# Altium project BEE-1012 PAY-EXP_V110.PrjPcb (part 6 of 7)

## Sheet 19_SOLENOID_HB_1.SchDoc
size 420 x 297 mm; SheetNumber: 31; SheetTotal: 36
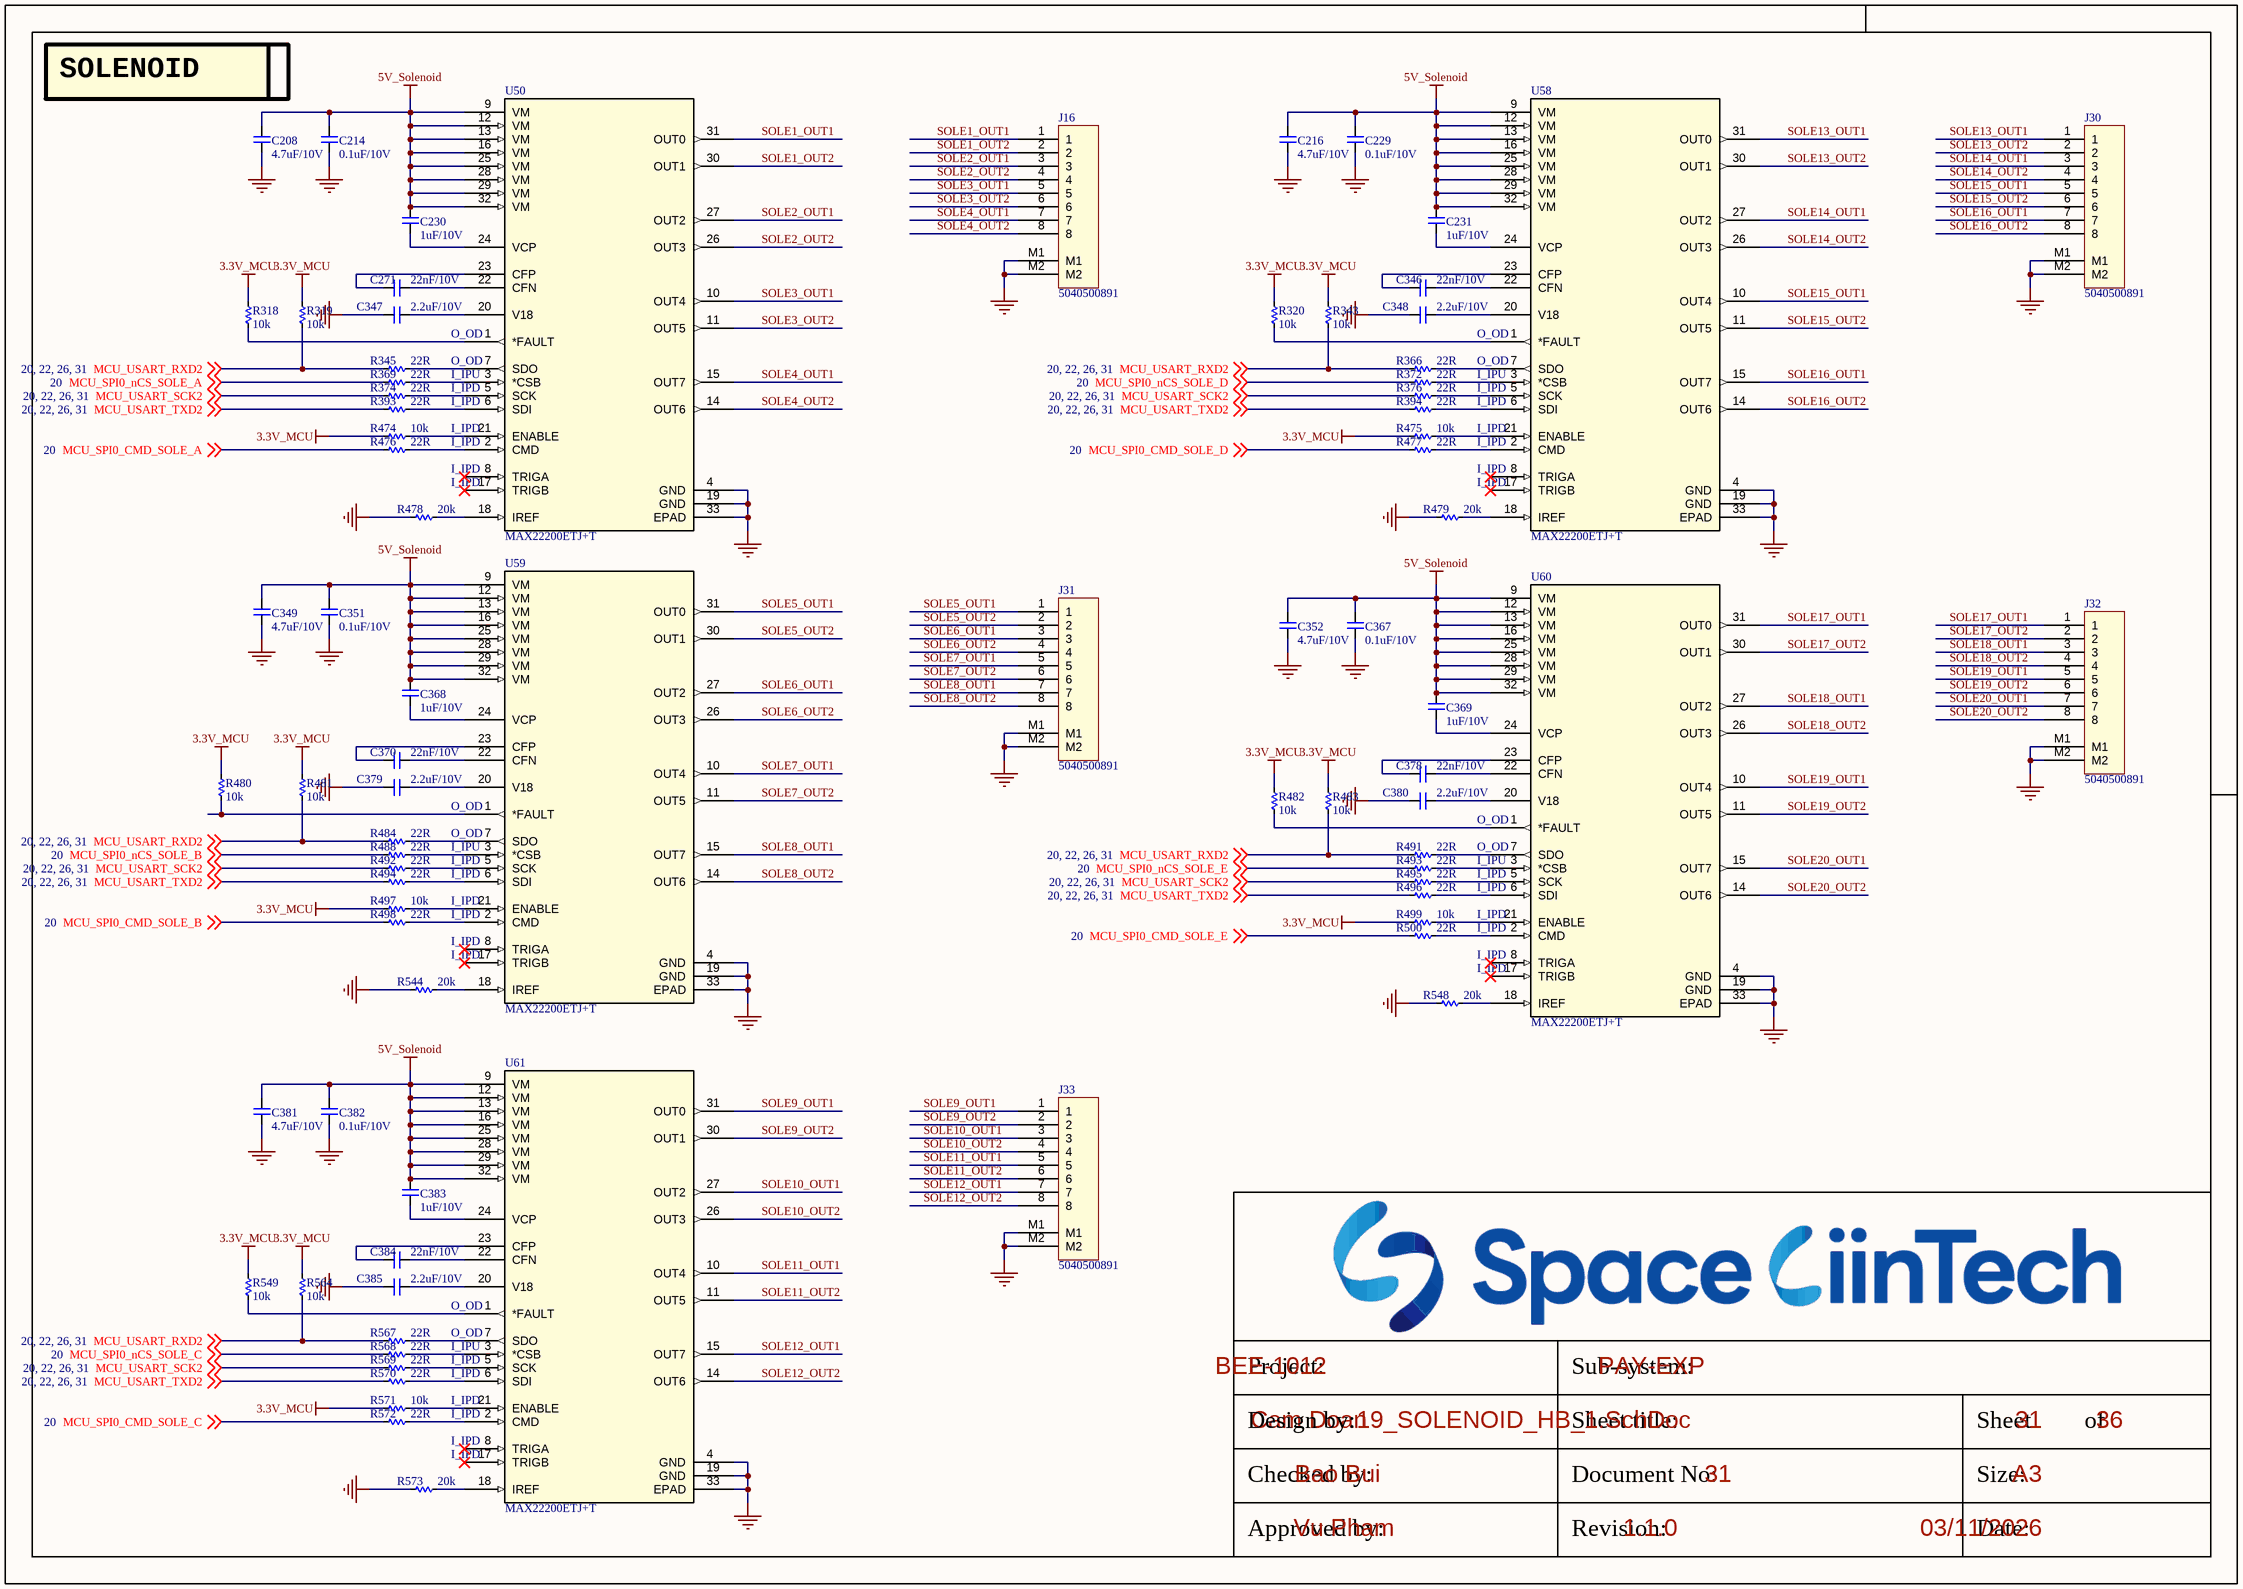
[diagram p32: 19_SOLENOID_HB_1.SchDoc]

### Parts
C208  4.7uF/10V  [CAP_C_1005X60]
C214  0.1uF/10V  [CAP_C_1005X60]
C216  4.7uF/10V  [CAP_C_1005X60]
C229  0.1uF/10V  [CAP_C_1005X60]
C230  1uF/10V  [CAP_C_1005X60]
C231  1uF/10V  [CAP_C_1005X60]
C271  22nF/10V  [CAP_C_1005X60]
C346  22nF/10V  [CAP_C_1005X60]
C347  2.2uF/10V  [CAP_C_1005X60]
C348  2.2uF/10V  [CAP_C_1005X60]
C349  4.7uF/10V  [CAP_C_1005X60]
C351  0.1uF/10V  [CAP_C_1005X60]
C352  4.7uF/10V  [CAP_C_1005X60]
C367  0.1uF/10V  [CAP_C_1005X60]
C368  1uF/10V  [CAP_C_1005X60]
C369  1uF/10V  [CAP_C_1005X60]
C370  22nF/10V  [CAP_C_1005X60]
C378  22nF/10V  [CAP_C_1005X60]
C379  2.2uF/10V  [CAP_C_1005X60]
C380  2.2uF/10V  [CAP_C_1005X60]
C381  4.7uF/10V  [CAP_C_1005X60]
C382  0.1uF/10V  [CAP_C_1005X60]
C383  1uF/10V  [CAP_C_1005X60]
C384  22nF/10V  [CAP_C_1005X60]
C385  2.2uF/10V  [CAP_C_1005X60]
J16  5040500891  [MOLEX_5040500891]
J30  5040500891  [MOLEX_5040500891]
J31  5040500891  [MOLEX_5040500891]
J32  5040500891  [MOLEX_5040500891]
J33  5040500891  [MOLEX_5040500891]
R318  10k  [RES_C_1005X40]
R319  10k  [RES_C_1005X40]
R320  10k  [RES_C_1005X40]
R343  10k  [RES_C_1005X40]
R345  22R  [RES_C_1005X40]
R366  22R  [RES_C_1005X40]
R369  22R  [RES_C_1005X40]
R372  22R  [RES_C_1005X40]
R374  22R  [RES_C_1005X40]
R376  22R  [RES_C_1005X40]
R393  22R  [RES_C_1005X40]
R394  22R  [RES_C_1005X40]
R474  10k  [RES_C_1005X40]
R475  10k  [RES_C_1005X40]
R476  22R  [RES_C_1005X40]
R477  22R  [RES_C_1005X40]
R478  20k  [RES_C_1005X40]
R479  20k  [RES_C_1005X40]
R480  10k  [RES_C_1005X40]
R481  10k  [RES_C_1005X40]
R482  10k  [RES_C_1005X40]
R483  10k  [RES_C_1005X40]
R484  22R  [RES_C_1005X40]
R488  22R  [RES_C_1005X40]
R491  22R  [RES_C_1005X40]
R492  22R  [RES_C_1005X40]
R493  22R  [RES_C_1005X40]
R494  22R  [RES_C_1005X40]
R495  22R  [RES_C_1005X40]
R496  22R  [RES_C_1005X40]
R497  10k  [RES_C_1005X40]
R498  22R  [RES_C_1005X40]
R499  10k  [RES_C_1005X40]
R500  22R  [RES_C_1005X40]
R544  20k  [RES_C_1005X40]
R548  20k  [RES_C_1005X40]
R549  10k  [RES_C_1005X40]
R564  10k  [RES_C_1005X40]
R567  22R  [RES_C_1005X40]
R568  22R  [RES_C_1005X40]
R569  22R  [RES_C_1005X40]
R570  22R  [RES_C_1005X40]
R571  10k  [RES_C_1005X40]
R572  22R  [RES_C_1005X40]
R573  20k  [RES_C_1005X40]
U50  MAX22200ETJ+T  [21-0140AK_T3255_8C_MXM]
U58  MAX22200ETJ+T  [21-0140AK_T3255_8C_MXM]
U59  MAX22200ETJ+T  [21-0140AK_T3255_8C_MXM]
U60  MAX22200ETJ+T  [21-0140AK_T3255_8C_MXM]
U61  MAX22200ETJ+T  [21-0140AK_T3255_8C_MXM]

### Nets
3.3V_MCU: R318.1 R319.1 R320.1 R343.1 R474.1 R475.1 R480.1 R481.1 R482.1 R483.1 R497.1 R499.1 R549.1 R564.1 R571.1
5V_Solenoid: C208.2 C214.2 C216.2 C229.2 C230.2 C231.2 C349.2 C351.2 C352.2 C367.2 C368.2 C369.2 C381.2 C382.2 C383.2 U50.9(VM) U50.12(VM) U50.13(VM) U50.16(VM) U50.25(VM) U50.28(VM) U50.29(VM) U50.32(VM) U58.9(VM) U58.12(VM) U58.13(VM) U58.16(VM) U58.25(VM) U58.28(VM) U58.29(VM) U58.32(VM) U59.9(VM) U59.12(VM) U59.13(VM) U59.16(VM) U59.25(VM) U59.28(VM) U59.29(VM) U59.32(VM) U60.9(VM) U60.12(VM) U60.13(VM) U60.16(VM) U60.25(VM) U60.28(VM) U60.29(VM) U60.32(VM) U61.9(VM) U61.12(VM) U61.13(VM) U61.16(VM) U61.25(VM) U61.28(VM) U61.29(VM) U61.32(VM)
GND: C208.1 C214.1 C216.1 C229.1 C347.1 C348.1 C349.1 C351.1 C352.1 C367.1 C379.1 C380.1 C381.1 C382.1 C385.1 J16.M1 J16.M2 J30.M1 J30.M2 J31.M1 J31.M2 J32.M1 J32.M2 J33.M1 J33.M2 R478.1 R479.1 R544.1 R548.1 R573.1 U50.4(GND) U50.19(GND) U50.33(EPAD) U58.4(GND) U58.19(GND) U58.33(EPAD) U59.4(GND) U59.19(GND) U59.33(EPAD) U60.4(GND) U60.19(GND) U60.33(EPAD) U61.4(GND) U61.19(GND) U61.33(EPAD)
MCU_SPI0_CMD_SOLE_A: R476.1 ; off-sheet MCU_SPI0_CMD_SOLE_A
MCU_SPI0_CMD_SOLE_B: R498.1 ; off-sheet MCU_SPI0_CMD_SOLE_B
MCU_SPI0_CMD_SOLE_C: R572.1 ; off-sheet MCU_SPI0_CMD_SOLE_C
MCU_SPI0_CMD_SOLE_D: R477.1 ; off-sheet MCU_SPI0_CMD_SOLE_D
MCU_SPI0_CMD_SOLE_E: R500.1 ; off-sheet MCU_SPI0_CMD_SOLE_E
MCU_SPI0_nCS_SOLE_A: R369.1 ; off-sheet MCU_SPI0_nCS_SOLE_A
MCU_SPI0_nCS_SOLE_B: R488.1 ; off-sheet MCU_SPI0_nCS_SOLE_B
MCU_SPI0_nCS_SOLE_C: R568.1 ; off-sheet MCU_SPI0_nCS_SOLE_C
MCU_SPI0_nCS_SOLE_D: R372.1 ; off-sheet MCU_SPI0_nCS_SOLE_D
MCU_SPI0_nCS_SOLE_E: R493.1 ; off-sheet MCU_SPI0_nCS_SOLE_E
MCU_USART_RXD2: R319.2 R343.2 R345.1 R366.1 R481.2 R483.2 R484.1 R491.1 R564.2 R567.1 ; off-sheet MCU_USART_RXD2
MCU_USART_SCK2: R374.1 R376.1 R492.1 R495.1 R569.1 ; off-sheet MCU_USART_SCK2
MCU_USART_TXD2: R393.1 R394.1 R494.1 R496.1 R570.1 ; off-sheet MCU_USART_TXD2
SOLE1_OUT1: J16.1 U50.31(OUT0)
SOLE1_OUT2: J16.2 U50.30(OUT1)
SOLE2_OUT1: J16.3 U50.27(OUT2)
SOLE2_OUT2: J16.4 U50.26(OUT3)
SOLE3_OUT1: J16.5 U50.10(OUT4)
SOLE3_OUT2: J16.6 U50.11(OUT5)
SOLE4_OUT1: J16.7 U50.15(OUT7)
SOLE4_OUT2: J16.8 U50.14(OUT6)
SOLE5_OUT1: J31.1 U59.31(OUT0)
SOLE5_OUT2: J31.2 U59.30(OUT1)
SOLE6_OUT1: J31.3 U59.27(OUT2)
SOLE6_OUT2: J31.4 U59.26(OUT3)
SOLE7_OUT1: J31.5 U59.10(OUT4)
SOLE7_OUT2: J31.6 U59.11(OUT5)
SOLE8_OUT1: J31.7 U59.15(OUT7)
SOLE8_OUT2: J31.8 U59.14(OUT6)
SOLE9_OUT1: J33.1 U61.31(OUT0)
SOLE9_OUT2: J33.2 U61.30(OUT1)
SOLE10_OUT1: J33.3 U61.27(OUT2)
SOLE10_OUT2: J33.4 U61.26(OUT3)
SOLE11_OUT1: J33.5 U61.10(OUT4)
SOLE11_OUT2: J33.6 U61.11(OUT5)
SOLE12_OUT1: J33.7 U61.15(OUT7)
SOLE12_OUT2: J33.8 U61.14(OUT6)
SOLE13_OUT1: J30.1 U58.31(OUT0)
SOLE13_OUT2: J30.2 U58.30(OUT1)
SOLE14_OUT1: J30.3 U58.27(OUT2)
SOLE14_OUT2: J30.4 U58.26(OUT3)
SOLE15_OUT1: J30.5 U58.10(OUT4)
SOLE15_OUT2: J30.6 U58.11(OUT5)
SOLE16_OUT1: J30.7 U58.15(OUT7)
SOLE16_OUT2: J30.8 U58.14(OUT6)
SOLE17_OUT1: J32.1 U60.31(OUT0)
SOLE17_OUT2: J32.2 U60.30(OUT1)
SOLE18_OUT1: J32.3 U60.27(OUT2)
SOLE18_OUT2: J32.4 U60.26(OUT3)
SOLE19_OUT1: J32.5 U60.10(OUT4)
SOLE19_OUT2: J32.6 U60.11(OUT5)
SOLE20_OUT1: J32.7 U60.15(OUT7)
SOLE20_OUT2: J32.8 U60.14(OUT6)
NetC230_1: C230.1 U50.24(VCP)
NetC231_1: C231.1 U58.24(VCP)
NetC271_1: C271.1 U50.22(CFN)
NetC271_2: C271.2 U50.23(CFP)
NetC346_1: C346.1 U58.22(CFN)
NetC346_2: C346.2 U58.23(CFP)
NetC347_2: C347.2 U50.20(V18)
NetC348_2: C348.2 U58.20(V18)
NetC368_1: C368.1 U59.24(VCP)
NetC369_1: C369.1 U60.24(VCP)
NetC370_1: C370.1 U59.22(CFN)
NetC370_2: C370.2 U59.23(CFP)
NetC378_1: C378.1 U60.22(CFN)
NetC378_2: C378.2 U60.23(CFP)
NetC379_2: C379.2 U59.20(V18)
NetC380_2: C380.2 U60.20(V18)
NetC383_1: C383.1 U61.24(VCP)
NetC384_1: C384.1 U61.22(CFN)
NetC384_2: C384.2 U61.23(CFP)
NetC385_2: C385.2 U61.20(V18)
NetR318_2: R318.2 U50.1(*FAULT)
NetR320_2: R320.2 U58.1(*FAULT)
NetR345_2: R345.2 U50.7(SDO)
NetR366_2: R366.2 U58.7(SDO)
NetR369_2: R369.2 U50.3(*CSB)
NetR372_2: R372.2 U58.3(*CSB)
NetR374_2: R374.2 U50.5(SCK)
NetR376_2: R376.2 U58.5(SCK)
NetR393_2: R393.2 U50.6(SDI)
NetR394_2: R394.2 U58.6(SDI)
NetR474_2: R474.2 U50.21(ENABLE)
NetR475_2: R475.2 U58.21(ENABLE)
NetR476_2: R476.2 U50.2(CMD)
NetR477_2: R477.2 U58.2(CMD)
NetR478_2: R478.2 U50.18(IREF)
NetR479_2: R479.2 U58.18(IREF)
NetR480_2: R480.2 U59.1(*FAULT)
NetR482_2: R482.2 U60.1(*FAULT)
NetR484_2: R484.2 U59.7(SDO)
NetR488_2: R488.2 U59.3(*CSB)
NetR491_2: R491.2 U60.7(SDO)
NetR492_2: R492.2 U59.5(SCK)
NetR493_2: R493.2 U60.3(*CSB)
NetR494_2: R494.2 U59.6(SDI)
NetR495_2: R495.2 U60.5(SCK)
NetR496_2: R496.2 U60.6(SDI)
NetR497_2: R497.2 U59.21(ENABLE)
NetR498_2: R498.2 U59.2(CMD)
NetR499_2: R499.2 U60.21(ENABLE)
NetR500_2: R500.2 U60.2(CMD)
NetR544_2: R544.2 U59.18(IREF)
NetR548_2: R548.2 U60.18(IREF)
NetR549_2: R549.2 U61.1(*FAULT)
NetR567_2: R567.2 U61.7(SDO)
NetR568_2: R568.2 U61.3(*CSB)
NetR569_2: R569.2 U61.5(SCK)
NetR570_2: R570.2 U61.6(SDI)
NetR571_2: R571.2 U61.21(ENABLE)
NetR572_2: R572.2 U61.2(CMD)
NetR573_2: R573.2 U61.18(IREF)

Not connected (* = marked no-connect by the designer): U50 8(TRIGA)* 17(TRIGB)*; U58 8(TRIGA)* 17(TRIGB)*; U59 8(TRIGA)* 17(TRIGB)*; U60 8(TRIGA)* 17(TRIGB)*; U61 8(TRIGA)* 17(TRIGB)*

### Notes on the sheet
- SOLENOID
- O_OD
- (near U50) I_IPU
- (near U50) I_IPD
- (near U50) O_OD
- (near U58) I_IPU
- (near U58) I_IPD
- (near U58) O_OD
- I_IPD
- (near U59) I_IPU
- (near U59) I_IPD
- (near U59) O_OD
- (near U60) I_IPU
- (near U60) O_OD
- (near U60) I_IPD
- (near U61) O_OD
- (near U61) I_IPU
- (near U61) I_IPD
- Project:
- Sub-system:
- Design by:
- Sheet title:
- Sheet
- of
- Checked by:
- Approved by:
- Revision:
- Document No:
- Size:
- Date:
- A3

### Library data of the parts
C208 C214 C216 C229-C231 C271 C346-C349 C351 C352 C367-C370 C378-C385 = _CAP_C_2: CAP CHIP
J16 J30-J33 = Header 8x1_2M
R318-R320 R343 R345 R366 R369 R372 R374 R376 R393 R394 R474-R484 R488 R491-R500 R544 R548 R549 R564 R567-R573 = _RES_B_2: RES
U50 U58-U61 = MAX22200ETJ+T: 36V, 1A Octal Integrated Serial-Controlled Solenoid and Motor Driver; Manufacturer_Name: Analog Devices Inc; Copyright: Copyright (C) 2026 Ultra Librarian. All rights reserved.; Manufacturer_Part_Number: MAX22200ETJ+T; RefDes: RefDes; Type: Type

## Sheet 19_SOLENOID_OF.SchDoc
size 420 x 297 mm; SheetNumber: 33; SheetTotal: 36
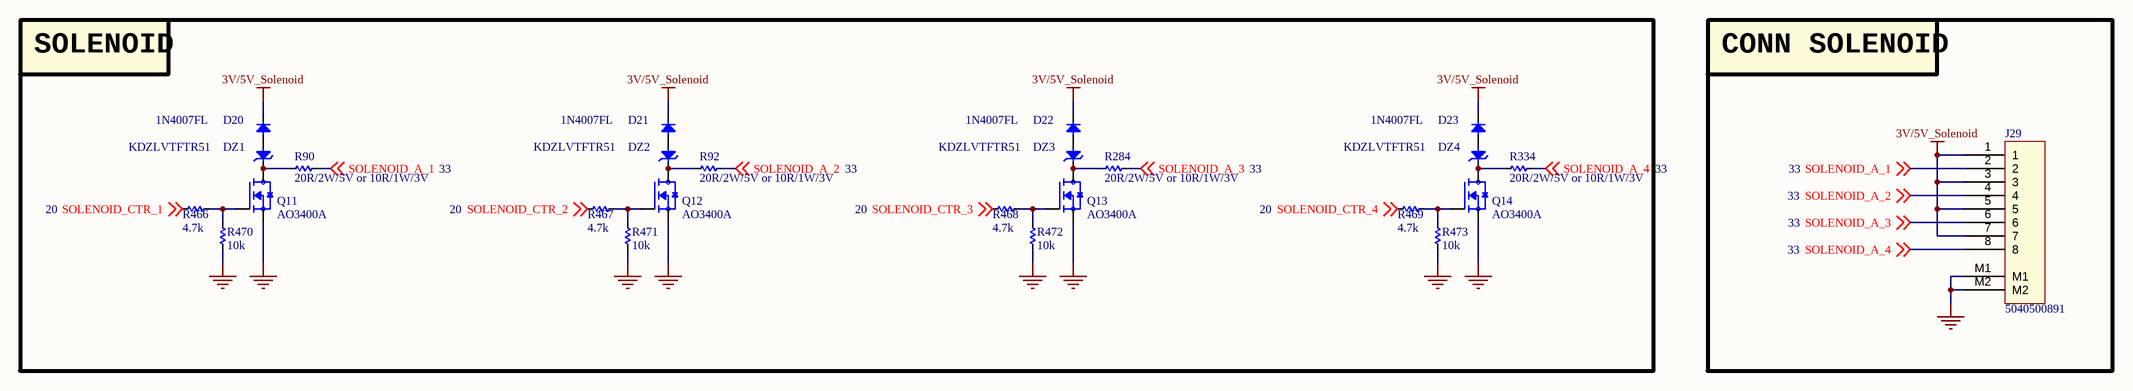
[diagram p33: 19_SOLENOID_OF.SchDoc]

### Parts
D20  1N4007FL  [SOD3717X145N]
D21  1N4007FL  [SOD3717X145N]
D22  1N4007FL  [SOD3717X145N]
D23  1N4007FL  [SOD3717X145N]
DZ1  KDZLVTFTR51  [SOD3717X145N]
DZ2  KDZLVTFTR51  [SOD3717X145N]
DZ3  KDZLVTFTR51  [SOD3717X145N]
DZ4  KDZLVTFTR51  [SOD3717X145N]
J29  5040500891  [MOLEX_5040500891]
Q11  AO3400A  [SOT95P240X120-3N]
Q12  AO3400A  [SOT95P240X120-3N]
Q13  AO3400A  [SOT95P240X120-3N]
Q14  AO3400A  [SOT95P240X120-3N]
R90  20R/2W/5V or 10R/1W/3V  [RES_C_6331X65_N]
R92  20R/2W/5V or 10R/1W/3V  [RES_C_6331X65_N]
R284  20R/2W/5V or 10R/1W/3V  [RES_C_6331X65_N]
R334  20R/2W/5V or 10R/1W/3V  [RES_C_6331X65_N]
R466  4.7k  [RES_C_1005X40]
R467  4.7k  [RES_C_1005X40]
R468  4.7k  [RES_C_1005X40]
R469  4.7k  [RES_C_1005X40]
R470  10k  [RES_C_1005X40]
R471  10k  [RES_C_1005X40]
R472  10k  [RES_C_1005X40]
R473  10k  [RES_C_1005X40]

### Blocks framed on the sheet
SOLENOID: D20-D23 DZ1-DZ4 Q11-Q14 R90 R92 R284 R334 R466-R473
CONN SOLENOID: J29

### Nets
3V/5V_Solenoid: D20.1(K) D21.1(K) D22.1(K) D23.1(K) J29.1 J29.3 J29.5 J29.7
GND: J29.M1 J29.M2 Q11.2(S) Q12.2(S) Q13.2(S) Q14.2(S) R470.1 R471.1 R472.1 R473.1
SOLENOID_A_1: J29.2 R90.1 ; off-sheet SOLENOID_A_1
SOLENOID_A_2: J29.4 R92.1 ; off-sheet SOLENOID_A_2
SOLENOID_A_3: J29.6 R284.1 ; off-sheet SOLENOID_A_3
SOLENOID_A_4: J29.8 R334.1 ; off-sheet SOLENOID_A_4
SOLENOID_CTR_1: R466.2 ; off-sheet SOLENOID_CTR_1
SOLENOID_CTR_2: R467.2 ; off-sheet SOLENOID_CTR_2
SOLENOID_CTR_3: R468.2 ; off-sheet SOLENOID_CTR_3
SOLENOID_CTR_4: R469.2 ; off-sheet SOLENOID_CTR_4
NetD20_2: D20.2(A) DZ1.2(A)
NetD21_2: D21.2(A) DZ2.2(A)
NetD22_2: D22.2(A) DZ3.2(A)
NetD23_2: D23.2(A) DZ4.2(A)
NetDZ1_1: DZ1.1(K) Q11.3(D) R90.2
NetDZ2_1: DZ2.1(K) Q12.3(D) R92.2
NetDZ3_1: DZ3.1(K) Q13.3(D) R284.2
NetDZ4_1: DZ4.1(K) Q14.3(D) R334.2
NetQ11_1: Q11.1(G) R466.1 R470.2
NetQ12_1: Q12.1(G) R467.1 R471.2
NetQ13_1: Q13.1(G) R468.1 R472.2
NetQ14_1: Q14.1(G) R469.1 R473.2

### Notes on the sheet
- Project:
- Sub-system:
- Design by:
- Sheet title:
- Sheet
- of
- Checked by:
- Approved by:
- Revision:
- Document No:
- Size:
- Date:
- A3

### Library data of the parts
D20-D23 = Diode SMD: as D5 on sheet 15_HEATER; Published: 8-Jun-2000; Revision: July-2002: Re-released for DXP Platform.; Publisher: Altium Limited
DZ1-DZ4 = DIODE Zener: Zenner
J29 = Header 8x1_2M
Q11-Q14 = MOSFET_N: as Q3 on sheet 15_HEATER; SnapEDA_Link: https://www.snapeda.com/parts/AO3400A/Alpha/view-part/?ref=snap; Package: SOT-23 Alpha &amp; Omega Semiconductor Inc.; Value: *; MP: AO3400A; Check_prices: https://www.snapeda.com/parts/AO3400A/Alpha/view-part/?ref=eda
R90 R92 R284 R334 R466-R473 = _RES_B_2: RES

## Sheet 20_AI_Board.SchDoc
size 420 x 297 mm; SheetNumber: 33; SheetTotal: 35
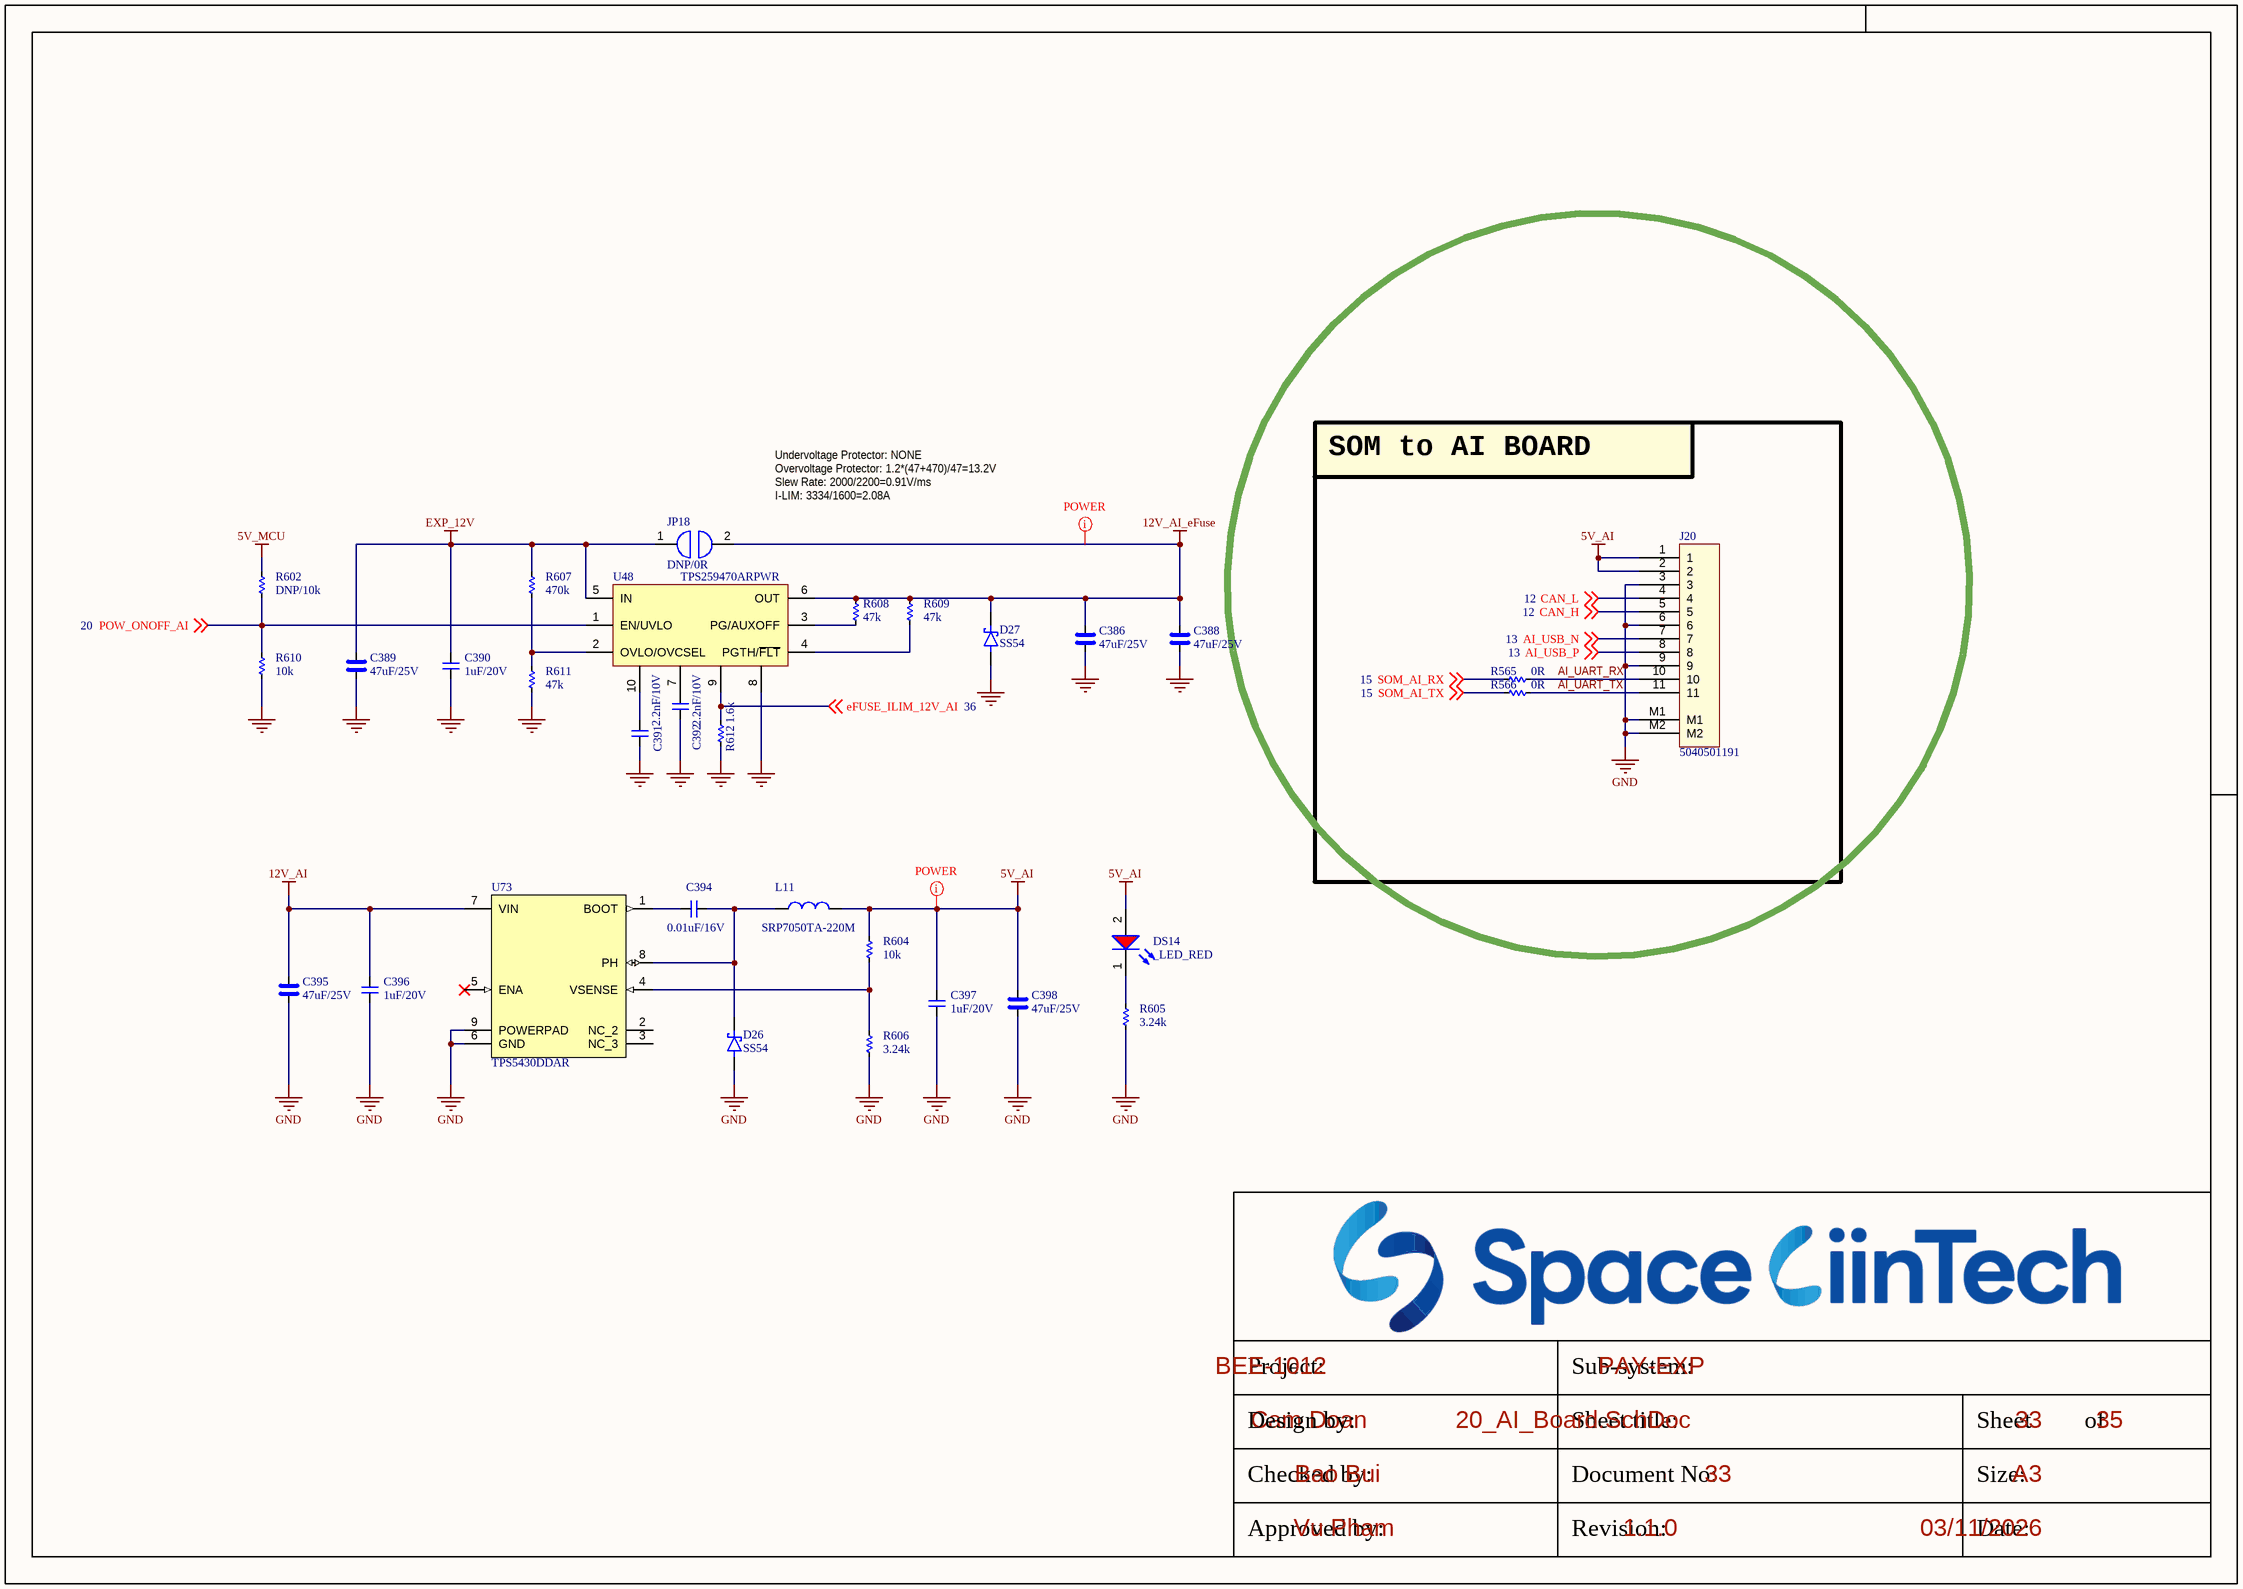
[diagram p34: 20_AI_Board.SchDoc]

### Parts
(Parts that share a designator on the sheet are numbered #1, #2 ... from top to bottom, then left to right.)
C386  47uF/25V  [CAP_C_3225X80]
C388  47uF/25V  [CAP_C_3225X80]
C389  47uF/25V  [CAP_C_3225X80]
C390  1uF/20V  [CAP_C_1005X60]
C391  2.2nF/10V  [CAP_C_1005X60]
C392  2.2nF/10V  [CAP_C_1005X60]
C394  0.01uF/16V  [CAP_C_1608X80]
C395  47uF/25V  [CAP_C_3225X80]
C396  1uF/20V  [CAP_C_1005X60]
C397  1uF/20V  [CAP_C_1005X60]
C398  47uF/25V  [CAP_C_3225X80]
D26  SS54  [DO-214AC_SMA]
D27  SS54  [DO-214AC_SMA]
DS14  _LED_RED  [LED_0603]
J20  5040501191  [MOLEX_5040501191]
JP18  DNP/0R  [JUMPER_1608]
L11  SRP7050TA-220M  [PSM6050]
R565  0R  [RES_C_1005X40]
R566  0R  [RES_C_1005X40]
R602  DNP/10k  [RES_C_1005X40]
R604  10k  [RES_C_1005X40]
R605  3.24k  [RES_C_1005X40]
R606  3.24k  [RES_C_1005X40]
R607  470k  [RES_C_1005X40]
R608  47k  [RES_C_1005X40]
R609  47k  [RES_C_1005X40]
R610  10k  [RES_C_1005X40]
R611  47k  [RES_C_1005X40]
R612  1.6k  [RES_C_1005X40]
U48  TPS259470ARPWR  [VQFN-HR-10]
U73#2  TPS5430DDAR  [TPS54531DDAR]

### Blocks framed on the sheet
SOM to AI BOARD: J20 R565 R566

### Nets
5V_AI: C397.2 C398.2 DS14.2(A) J20.1 J20.2 L11.2 R604.2
5V_MCU: R602.1
12V_AI: C395.2 C396.2 U73#2.7(VIN)
12V_AI_eFuse: C386.2 C388.2 D27.1(K) JP18.2 R608.2 R609.2 U48.6(OUT)
EXP_12V: C389.2 C390.2 JP18.1 R607.2 U48.5(IN)
GND: C386.1 C388.1 C389.1 C390.1 C391.1 C392.1 C395.1 C396.1 C397.1 C398.1 D26.2(A) D27.2(A) J20.3 J20.6 J20.9 J20.M1 J20.M2 R605.1 R606.1 R610.2 R611.1 R612.1 U48.8 U73#2.6(GND) U73#2.9(POWERPAD)
AI_UART_RX: J20.10 R565.2
AI_UART_TX: J20.11 R566.2
AI_USB_N: J20.7 ; off-sheet AI_USB_N  [project net USBB_N]
AI_USB_P: J20.8 ; off-sheet AI_USB_P  [project net USBB_P]
CAN_H: J20.5 ; off-sheet CAN_H
CAN_L: J20.4 ; off-sheet CAN_L
eFUSE_ILIM_12V_AI: R612.2 U48.9 ; off-sheet eFUSE_ILIM_12V_AI
POW_ONOFF_AI: R602.2 R610.1 U48.1(EN/UVLO) ; off-sheet POW_ONOFF_AI
SOM_AI_RX: R565.1 ; off-sheet SOM_AI_RX
SOM_AI_TX: R566.1 ; off-sheet SOM_AI_TX
NetC391_2: C391.2 U48.10
NetC392_2: C392.2 U48.7
NetC394_1: C394.1 D26.1(K) L11.1 U73#2.8(PH)
NetC394_2: C394.2 U73#2.1(BOOT)
NetDS14_1: DS14.1(K) R605.2
NetR604_1: R604.1 R606.2 U73#2.4(VSENSE)
NetR607_1: R607.1 R611.2 U48.2(OVLO/OVCSEL)
NetR608_1: R608.1 U48.3(PG/AUXOFF)
NetR609_1: R609.1 U48.4(PGTH/~{FLT})

Not connected (* = marked no-connect by the designer): U73#2 2(NC_2) 3(NC_3) 5(ENA)*

### Layout directives
net class POWER: 5V_AI, 12V_AI_eFuse

### Notes on the sheet
- Undervoltage Protector: NONE
- Overvoltage Protector: 1.2*(47+470)/47=13.2V
- Slew Rate: 2000/2200=0.91V/ms
- I-LIM: 3334/1600=2.08A
- Project:
- Sub-system:
- Design by:
- Sheet title:
- Sheet
- of
- Checked by:
- Approved by:
- Revision:
- Document No:
- Size:
- Date:
- A3

### Library data of the parts
C386 C388 C389 C395 C398 = _CAP_C_High_2: CAP High Value
C390-C392 C394 C396 C397 = _CAP_C_2: CAP
D26 D27 = DIODE SCHOTTKY
J20 = Header 11x1_2M
JP18 = JUMPER
L11 = SRP7050TA-220M: FIXED IND 22UH 2.5A 170 MOHM SMD
R565 R566 R602 R604-R612 = _RES_B_2: RES
U73#2 = TPS5430DDAR: IC REG BUCK ADJ 3A 8SOPWR